# EAGLE design SoundSensor (EAGLE 7.3.0)
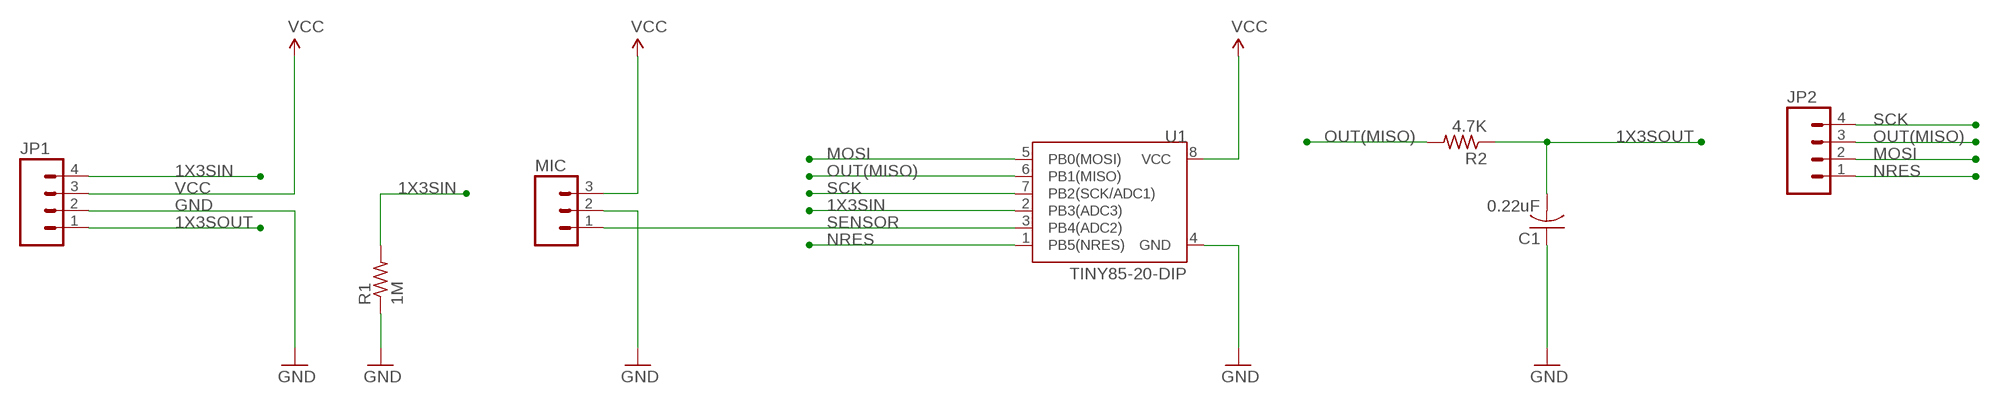
[diagram p0: schematic, sheet 1]

## Parts
C1  0.22uF  C-USC0402  [C0402]
JP1  M04PTH  [1X04]
JP2  M04PTH  [1X04]
MIC  M03PTH  [1X03]
R1  1M  R-US_R0603  [R0603]
R2  4.7K  R-US_R0603  [R0603]
U1  TINY85-20-DIP  ATTINY45TINY85-20-DIP  [DIP08]

## Nets
1X3SIN: JP1.4 R1.2 U1.2(PB3(ADC3))
1X3SOUT: C1.2 JP1.1 R2.1
GND: C1.1 JP1.2 MIC.2 R1.1 U1.4(GND)
MOSI: JP2.2 U1.5(PB0(MOSI))
NRES: JP2.1 U1.1(PB5(NRES))
OUT(MISO): JP2.3 R2.2 U1.6(PB1(MISO))
SCK: JP2.4 U1.7(PB2(SCK/ADC1))
SENSOR: MIC.1 U1.3(PB4(ADC2))
VCC: JP1.3 MIC.3 U1.8(VCC)

## Library data of the parts
C1 = adafruit:C-US: CAPACITOR, American symbol
JP1 JP2 = SparkFun-Connectors:M04: Header 4 Standard 4-pin 0.1" header. Use with straight break away headers (SKU : PRT-00116), right angle break away headers (PRT-00553), swiss pins (PRT-00743), machine pins (PRT-00117), and female headers (PRT-00115). Molex polarized connector foot print use with SKU : PRT-08231 with associated crimp pins and housings. 1MM SMD Version SKU: PRT-10208
MIC = SparkFun-Connectors:M03: Header 3 Standard 3-pin 0.1" header. Use with straight break away headers (SKU : PRT-00116), right angle break away headers (PRT-00553), swiss pins (PRT-00743), machine pins (PRT-00117), and female headers (PRT-00115). Molex polarized connector foot print use with SKU : PRT-08232 with associated crimp pins and housings.
R1 R2 = adafruit:R-US_: RESISTOR, American symbol
U1 = SparkFun-DigitalIC:ATTINY45: Atmel 8-pin 2/4/8kB flash uC; PROD_ID: IC-09445

## Board
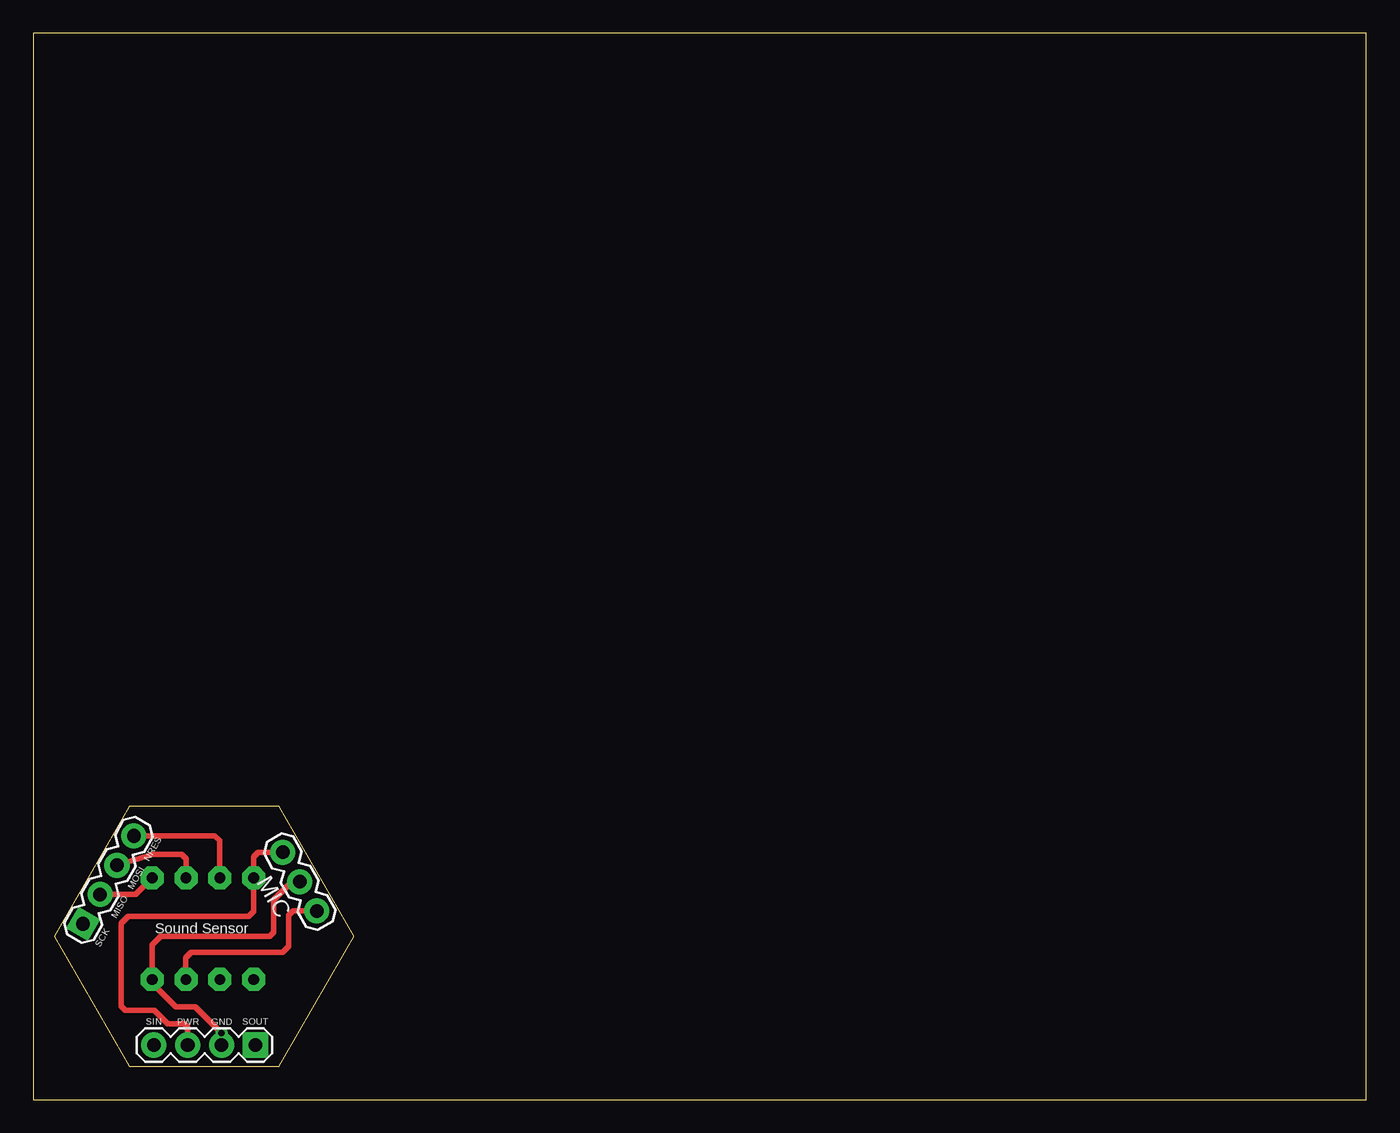
[diagram p1: board, top side]
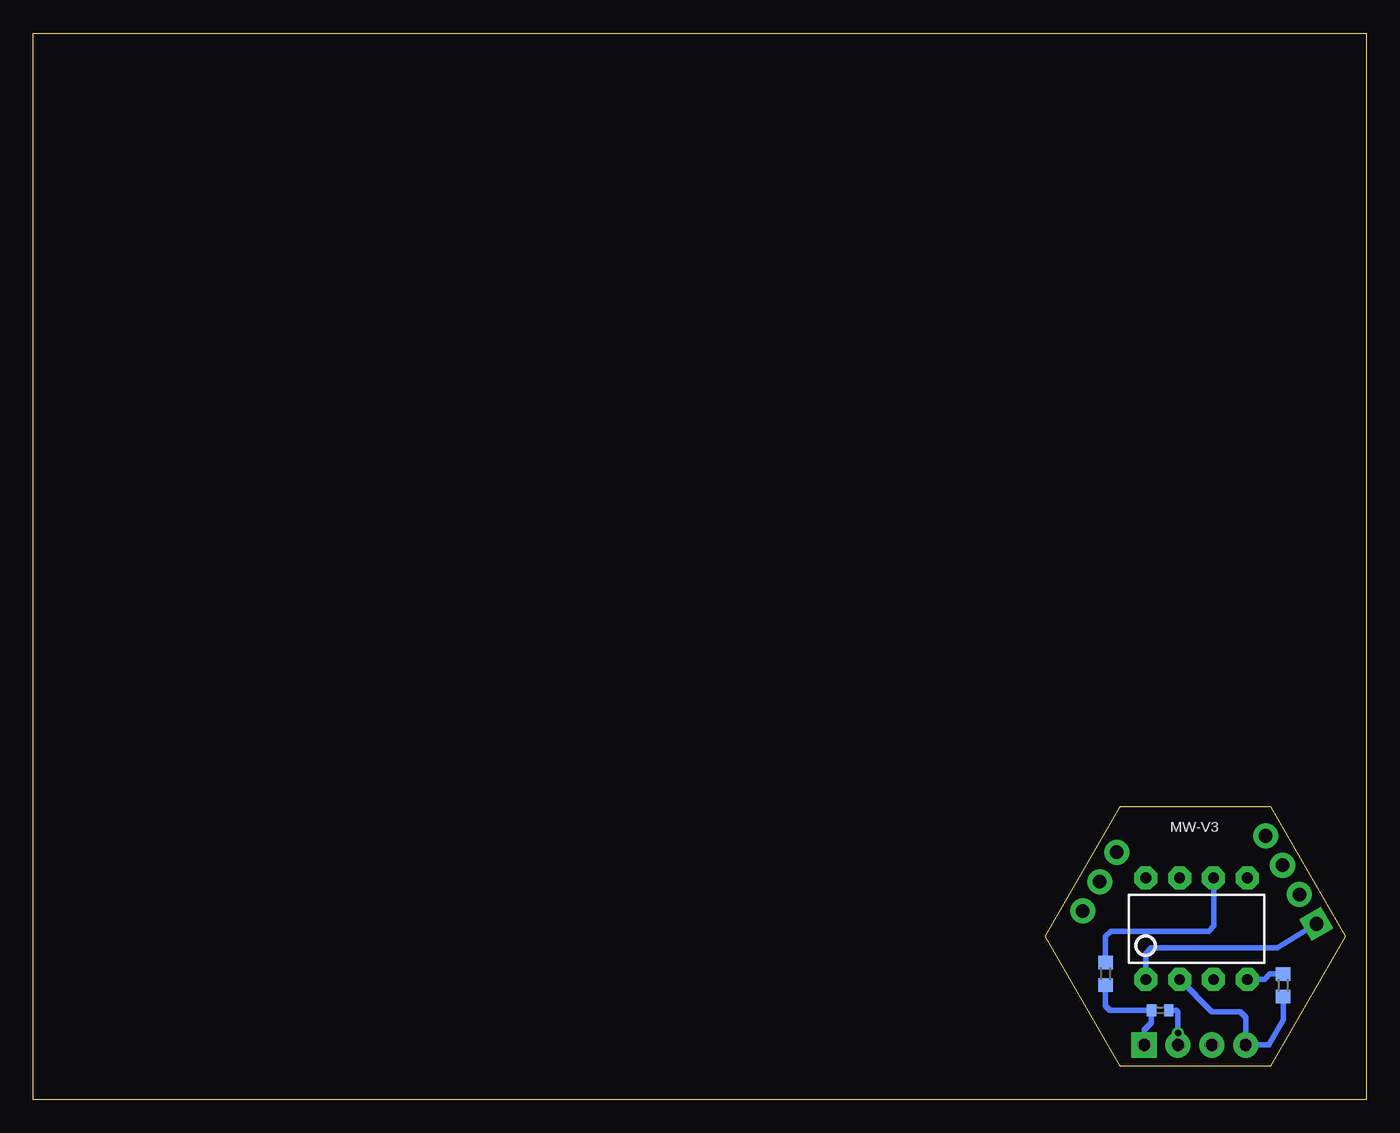
[diagram p2: board, bottom side, seen from below]

Size 100 x 80 mm. Coordinates in mm from the lower left corner, seen from the top.
Outline: 0,0 100,0 100,80 0,80 0,0
Outline: 7.18,2.5 18.43,2.5 24.05,12.24 18.43,21.98 7.18,21.98 1.55,12.24 7.18,2.5
Copper layers (1*16): Top 0.035mm / dielectric 1.5mm / Bottom 0.035mm
Design rules "default": minimum track width 10mil, minimum drill 24mil, track to track 8mil, track to pad 8mil, pad to pad 8mil, via to via 8mil, smd to smd 8mil, copper to edge 40mil, drill to drill 8mil, minimum pad ring 10mil, minimum via ring 8mil, stop-mask expansion 4mil, vias tented up to drill 0mil, thermal gap 10mil

### Footprints (pad centres in the part's own frame; a part is rotated, then mirrored left to right if it is on the bottom)
C0402 = smd 0.7 x 0.9: 1 -0.65,0; 2 0.65,0
1X04 = drill 1.016 pad 1.88 square: 1 0,0 | drill 1.016 pad 1.88: 2 2.54,0; 3 5.08,0; 4 7.62,0
1X03 = drill 1.016 pad 1.88: 1 0,0; 2 2.54,0; 3 5.08,0
R0603 = smd 1 x 1.1: 1 -0.85,0; 2 0.85,0
DIP08 = drill 0.813 pad 1.727 octagon: 1 -3.81,-3.81; 2 -1.27,-3.81; 3 1.27,-3.81; 4 3.81,-3.81; 5 3.81,3.81; 6 1.27,3.81; 7 -1.27,3.81; 8 -3.81,3.81

### Placement (x,y rotation side)
C1  15.46,6.71 180 bottom
JP1  16.66,4.09 180 top
JP2  3.73,13.18 60 top
MIC  21.26,14.15 120 top
R1  6.24,8.57 270 bottom
R2  19.56,9.44 90 bottom
U1  12.73,12.81 0 bottom

### Tracks (layer width: path | path; a pad name or v marks a point on that pad's centre or on a via)
1X3SIN
  Bottom 0.4: R1.2 6.24,6.01 6.22,5.99 7.29,4.09 JP1.4 9.03,4.1 9.03,6.16 9.45,6.58 11.57,6.58 U1.2
1X3SOUT
  Bottom 0.4: JP1.1 16.66,5.22 16.12,5.77 16.12,6.7 C1.2 19.21,6.71 19.56,7.05 R2.1
GND  (via drill 0.5)
  Top 0.4: MIC.2 19.38,16.35 18.03,15 18.03,12.56 17.73,12.26 9.55,12.26 8.91,11.62 U1.4 9.23,8.69 9.23,8.42 10.68,6.97 12.13,6.97 v14.12,4.98 JP1.2
  Bottom 0.4: R1.1 7.21,9.42 7.61,9.03 8.89,9.03 U1.4 | v14.12,4.98 14.12,6.58 14.24,6.69 14.79,6.69 C1.1
MOSI
  Top 0.4: JP2.2 7.67,15.38 U1.5
NRES
  Bottom 0.4: U1.1 16.54,10.97 16.14,11.37 6.67,11.37 6.66,11.38 JP2.1
OUT(MISO)
  Top 0.4: U1.6 11.46,18.05 11.11,18.39 8.95,18.39 JP2.3
  Bottom 0.4: R2.2 19.56,12.23 19.15,12.64 11.81,12.64 11.43,13.02 11.43,16.6 U1.6
SCK
  Top 0.4: JP2.4 13.62,19.78 13.97,19.43 13.97,16.65 U1.7
SENSOR
  Top 0.4: MIC.1 19.48,14.15 19.14,13.8 19.14,11.48 18.69,11.04 11.84,11.04 11.44,10.64 11.44,9.02 U1.3
VCC
  Top 0.4: MIC.3 16.87,18.55 16.52,18.2 16.52,16.64 U1.8 16.54,14.12 16.15,13.74 7.12,13.74 6.6,13.22 6.6,7 6.91,6.69 9.05,6.69 10.07,5.68 11.32,5.68 11.58,5.41 JP1.3

### Text on the board
tPlace: NRES | MOSI | MISO | SCK | Sound Sensor | SIN | PWR | GND | SOUT
bPlace: MW-V3